# Altium schematic sheet Input Buffer.SchDoc
size A4; SheetNumber: 2; SheetTotal: 7
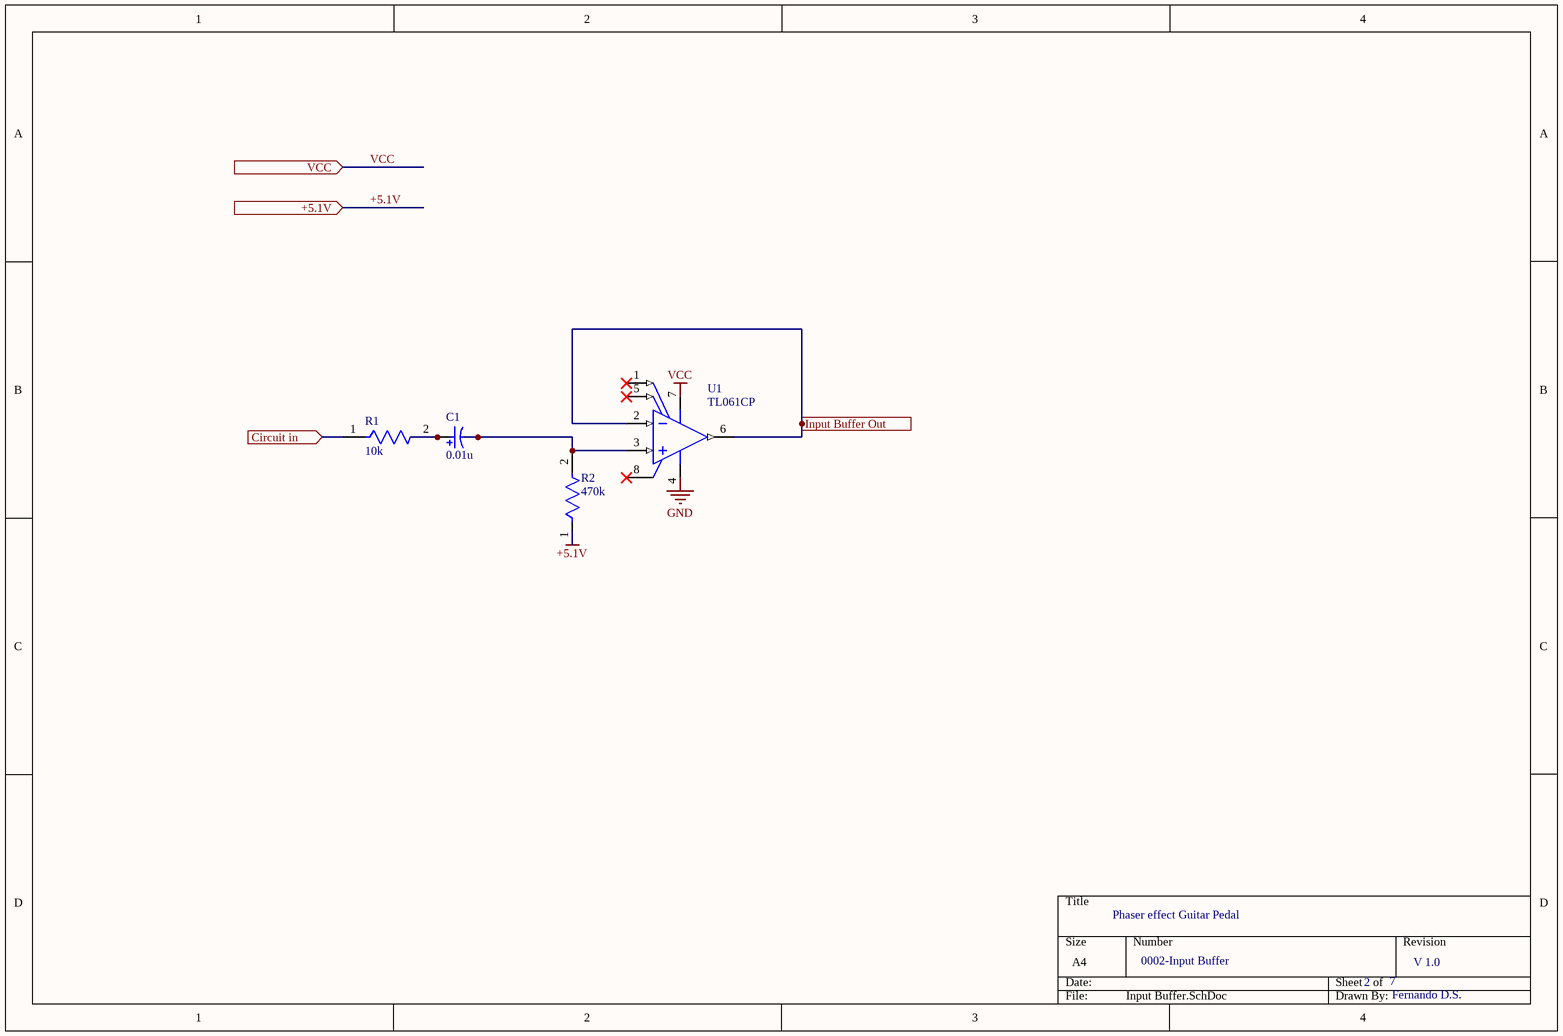
[diagram p0: Input Buffer.SchDoc]

## Parts
C1  0.01u  [NIC-PLF-10x13-2_V]
R1  10k  [FP-MRS25-MFG]
R2  470k  [FP-MRS25-MFG]
U1  TL061CP  [P0008A]

## Ports
+5.1V (in, see Main[1B], LFO[1A], Output Mixer[1A], Phase Shifting Stage[1A], Power supply[4A]), Circuit in (in, see Main[1B]), Input Buffer Out (out, see Main[2B]), VCC (in, see Main[1B], LFO[1A], Phase Shifting Stage[1A], Power supply[4B], Selection[1A])

## Nets
+5.1V: R2.1 ; port +5.1V
VCC: port VCC
Circuit in: R1.1 ; port Circuit in
Input Buffer Out: U1.2(IN-) U1.6(OUT) ; port Input Buffer Out
NetC1_1: C1.1 R1.2
NetC1_2: C1.2 R2.2 U1.3(IN+)

Not connected (* = marked no-connect by the designer): U1 1(OFFSET_N1)* 4(VCC-) 5(OFFSET_N2)* 7(VCC+) 8(NC)*

## Notes on the sheet
- Phaser effect Guitar Pedal
- 0002-Input Buffer
- 2
- 7
- V 1.0
- Fernando D.S.
- Labels drawn without touching a wire or pin: GND, VCC

## Library data of the parts
C1 = CMP-1234-00001-1: Aluminum Electrolytic Capacitor, 470 uF +/-20%, 10 V, -55 to 105 degC, 2-Pin THD, RoHS; Manufacturer: Nichicon; PartNumber: PLF1A471MDO1; Leakage Current: 0.94 mA; Rated Ripple: 5700 mA; Rated Voltage: 10 V; Rated Capacitance: 470 uF; ComponentLink3URL: http://nichicon-us.com/english/products/pdfs/e-lf.pdf; PackageDescription: 2-Pin Through Hole Device, Dia 10 mm, Body Length 13 mm, Pin Spacing 5 mm; ComponentLink2URL: http://nichicon-us.com/english/products/pdfs/e-lf.pdf; RoHS: TRUE; ComponentLink1URL: http://www.nichicon.co.jp/; ComponentLink2Description: Datasheet; Capacitance Tolerance: +/-20%; ComponentLink1Description: Manufacturer URL; Mounting Technology: Through Hole; ComponentLink3Description: Package Specification; Temperature Range: -55 to 105 degC; DatasheetVersion: Sep-13
R1 R2 = CMP-00030-42757237-1: MRS25000C1000FRP00 Resistor, 100 Ohm, ± 1%, 600 mW, Axial Leaded, Metal Film (Thin Film), Professional; Max Power Dissipation: 600mW; Resistance: 100Ω; Voltage Rating: 350V; Temperature Coefficient: 50ppm/°C; Lead Diameter: 600µm; RoHS: Compliant; Radiation Hardening: No; Schedule B: 8533210090, 8533210090; Length: 6.5mm; Packaging: Tape & Reel (TR); Number of Terminations: 2; Mount: Through Hole; Width: 2.5mm; Tolerance: 1%; Military Standard: Not; Voltage Rating (DC): 350V; Contact Plating: Tin; Number of Pins: 2; Max Operating Temperature: 155°C; NexarPartId: 42757237; Diameter: 2.5mm; Composition: Metal Film, Thin Film; REACH SVHC: Unknown; Power Rating: 600mW; Lead Free: Lead Free; Termination: Axial; Case/Package: Axial; Min Operating Temperature: -55°C
U1 = CMP-0017-01052-2: Low-Power JFET-Input General-Purpose Operational Amplifier, 7 to 36 V, 0 to 70 degC, 8-pin DIP (P8), Pb-Free (RoHS); Manufacturer: Texas Instruments; CMRR(Min)(dB): 70; Offset Drift(Typ)(uV/C): 10; Vio (25C)(Max)(mV): 15; Rating: Military; Total Supply Voltage(Min)(+5V is 5, +/-5V is 10): 7; Vn at 1kHz(Typ)(nV/rtHz): 42; GBW(Typ)(MHz): 1; Total Supply Voltage(Max)(+5V is 5, +/-5V is 10): 36; Sub Family: General Purpose Amplifier, High Supply Voltage Amplifier (>=30V), Low Power Amp (<=500uA); Slew Rate(Typ)(V/us): 3.5; Iq per channel(Max)(mA): 0.25; IIB(Max)(pA): 400; ComponentLink2URL: http://www.ti.com/lit/ds/symlink/tl061.pdf; Mounting Technology: Through Hole; Code_JEDEC: MS-001; PackageVersion: 4040082/E, 04/2010; ComponentLink1URL: http://www.ti.com/; PartNumber: TL061CP; PackageReference: P0008A; ComponentLink1Description: Manufacturer URL; Eco-Plan: Pb-Free (RoHS); ComponentLink3URL: http://www.ti.com/litv/pdf/mpdi001b; Number of Channels: 1; DatasheetVersion: SLOS078J; ComponentLink3Description: Package Specification; PackageDescription: 8-Pin Plastic In-Line, Body 9.59 x 6.35 mm, Pitch 2.54 mm; ComponentLink2Description: Datasheet